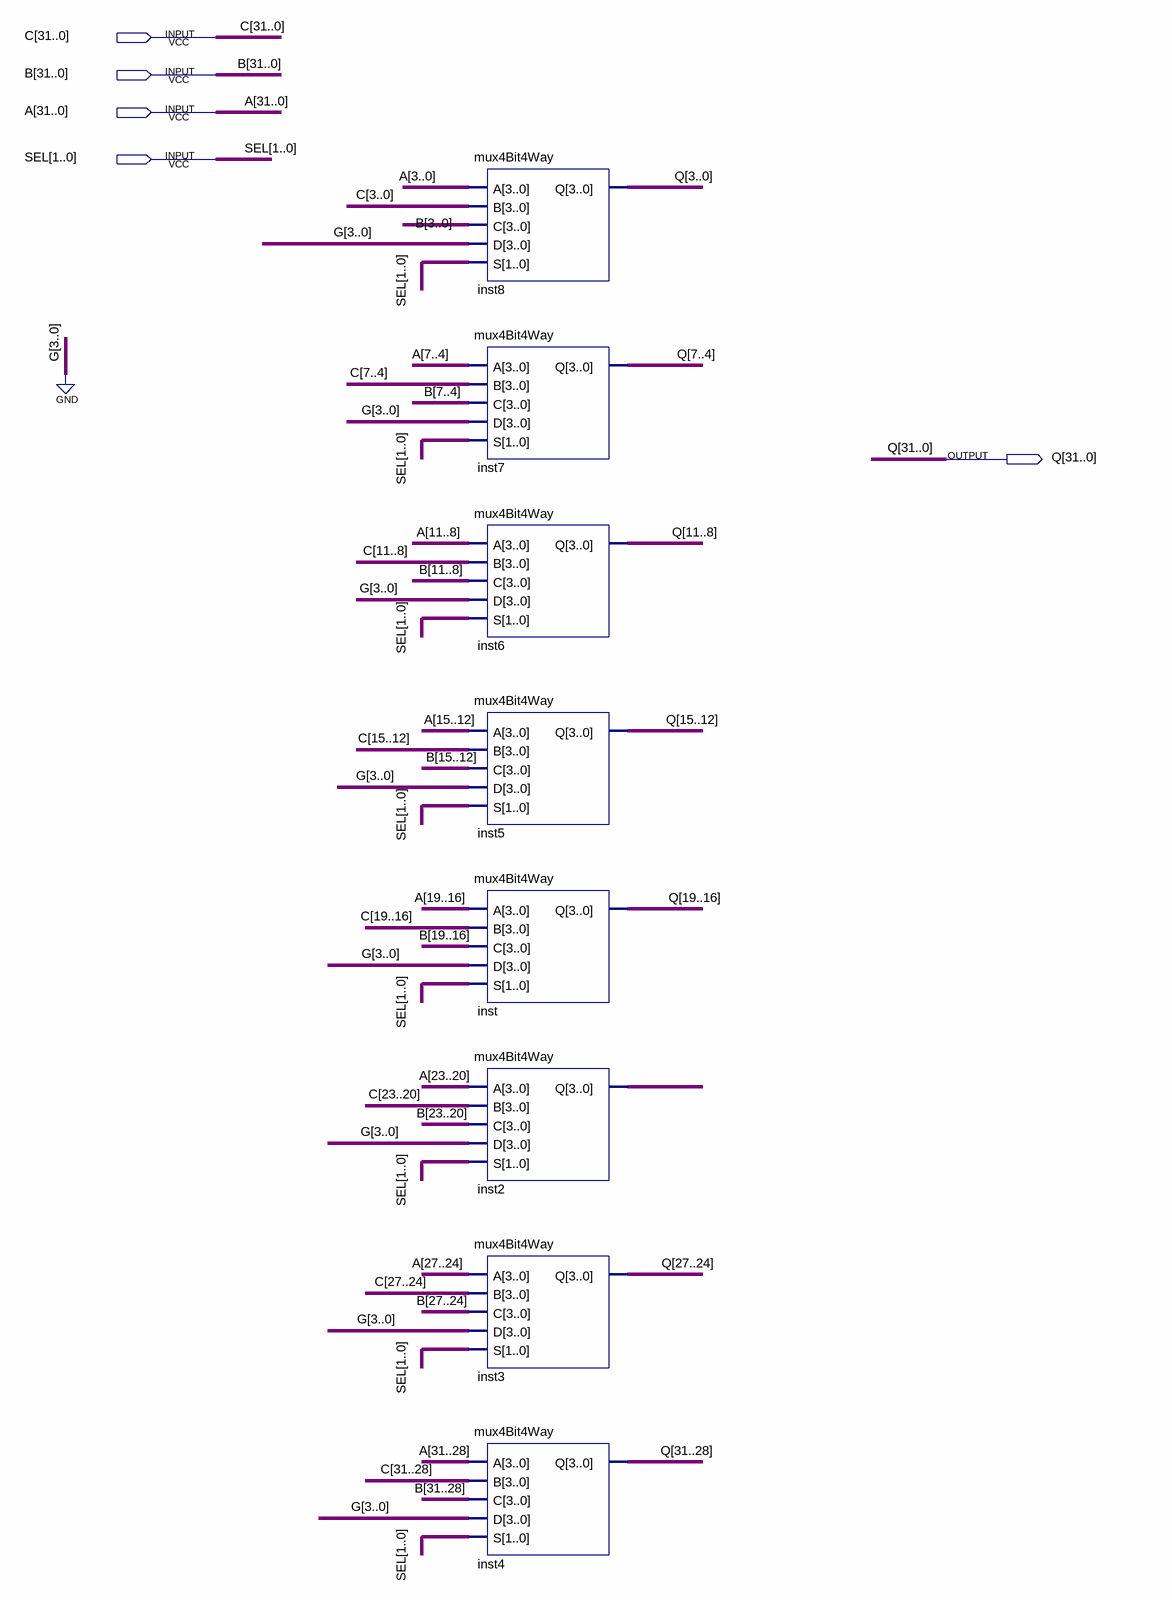
[diagram p0: schematic sheet]
// Quartus schematic mux32Bit3Way.bdf as structural Verilog: 8 symbols, 5 pins
module mux32Bit3Way (
  input  [31:0] C,
  input  [31:0] B,
  input  [31:0] A,
  input  [1:0] SEL,
  output [31:0] Q
);

  wire [3:0] inst2_q;

  mux4Bit4Way inst8 (.A(A[3:0]), .B(C[3:0]), .C(B[3:0]), .D(4'b0000), .S(SEL), .Q(Q[3:0]));
  mux4Bit4Way inst7 (.A(A[7:4]), .B(C[7:4]), .C(B[7:4]), .D(4'b0000), .S(SEL), .Q(Q[7:4]));
  mux4Bit4Way inst6 (.A(A[11:8]), .B(C[11:8]), .C(B[11:8]), .D(4'b0000), .S(SEL), .Q(Q[11:8]));
  mux4Bit4Way inst5 (.A(A[15:12]), .B(C[15:12]), .C(B[15:12]), .D(4'b0000), .S(SEL), .Q(Q[15:12]));
  mux4Bit4Way inst (.A(A[19:16]), .B(C[19:16]), .C(B[19:16]), .D(4'b0000), .S(SEL), .Q(Q[19:16]));
  mux4Bit4Way inst2 (.A(A[23:20]), .B(C[23:20]), .C(B[23:20]), .D(4'b0000), .S(SEL), .Q(inst2_q));
  mux4Bit4Way inst3 (.A(A[27:24]), .B(C[27:24]), .C(B[27:24]), .D(4'b0000), .S(SEL), .Q(Q[27:24]));
  mux4Bit4Way inst4 (.A(A[31:28]), .B(C[31:28]), .C(B[31:28]), .D(4'b0000), .S(SEL), .Q(Q[31:28]));
endmodule
